# Altium project Motor Board.PrjPcb
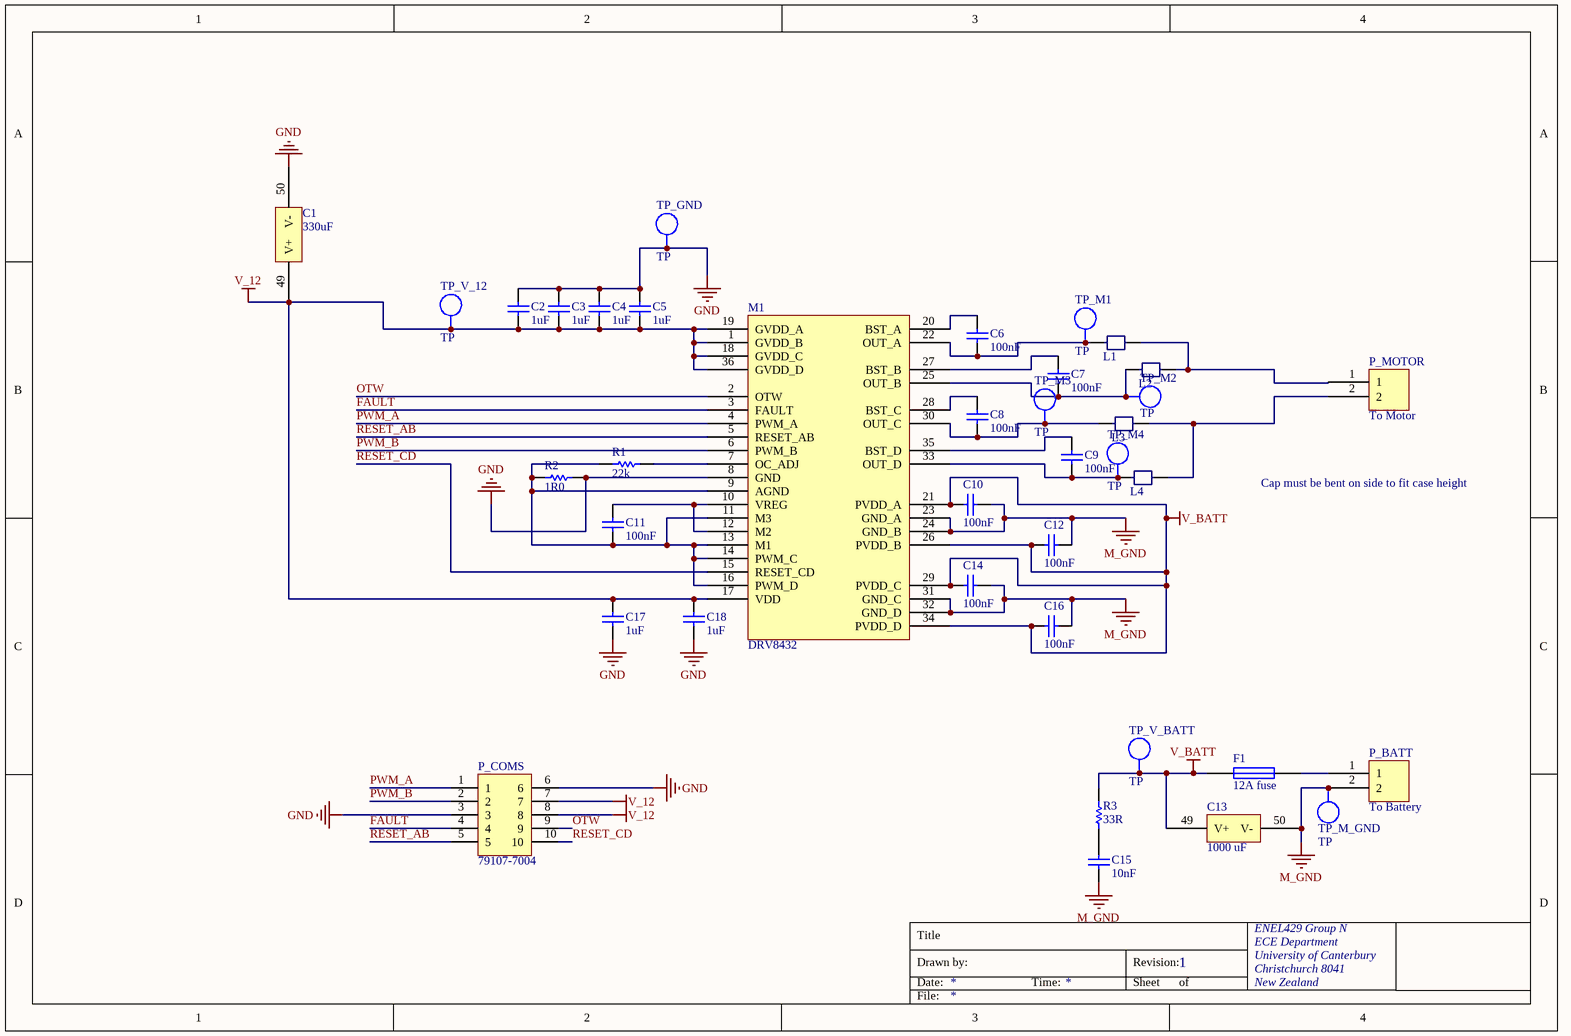
[diagram p0: Motor Driver.SchDoc]
1 sheet, 38 parts. Net scope: global (net labels, ports and power ports of the same name join across sheets).
Board file: Motor Board.PcbDoc

## Sheet Motor Driver.SchDoc
size A4; Organization: ENEL429 Group N; Address1: ECE Department; Address2: University of Canterbury; Address3: Christchurch 8041; Address4: New Zealand; Revision: 1

### Parts
C1  330uF  [330uF Capacitor]
C2  1uF  [0603]
C3  1uF  [0603]
C4  1uF  [0603]
C5  1uF  [0603]
C6  100nF  [0603]
C7  100nF  [0603]
C8  100nF  [0603]
C9  100nF  [0603]
C10  100nF  [0603]
C11  100nF  [0603]
C12  100nF  [0603]
C13  1000 uF  [Capacitor 1000uF]
C14  100nF  [0603]
C15  10nF  [0603]
C16  100nF  [0603]
C17  1uF  [0603]
C18  1uF  [0603]
F1  12A fuse  [RESC3216L]
L1  FERRITE BEAD 10A  (value not drawn)
L2  FERRITE BEAD 10A  (value not drawn)
L3  FERRITE BEAD 10A  (value not drawn)
L4  FERRITE BEAD 10A  (value not drawn)
M1  DRV8432  [DRV8432]
P_BATT  To Battery  [0010844020]
P_COMS  79107-7004  [79107-7004]
P_MOTOR  To Motor  [0010844020]
R1  22k  [0603]
R2  1R0  [0603]
R3  33R  [0603]
TP_GND  TP  [TEST_POINT_4X2MM]  (no BOM)
TP_M1  TP  [TEST_POINT_4X2MM]  (no BOM)
TP_M2  TP  [TEST_POINT_4X2MM]  (no BOM)
TP_M3  TP  [TEST_POINT_4X2MM]  (no BOM)
TP_M4  TP  [TEST_POINT_4X2MM]  (no BOM)
TP_M_GND  TP  [TEST_POINT_4X2MM]  (no BOM)
TP_V_12  TP  [TEST_POINT_4X2MM]  (no BOM)
TP_V_BATT  TP  [TEST_POINT_4X2MM]  (no BOM)

### Nets
GND: C1.50(V-) C2.1 C3.1 C4.1 C5.1 C17.2 C18.2 M1.8(GND) P_COMS.3 P_COMS.6 R2.2 TP_GND.1
M_GND: C10.1 C12.1 C13.50(V-) C14.1 C15.1 C16.1 M1.23(GND_A) M1.24(GND_B) M1.31(GND_C) M1.32(GND_D) P_BATT.2 TP_M_GND.1
V_12: C1.49(V+) C2.2 C3.2 C4.2 C5.2 C17.1 C18.1 M1.1(GVDD_B) M1.17(VDD) M1.18(GVDD_C) M1.19(GVDD_A) M1.36(GVDD_D) P_COMS.7 P_COMS.8 TP_V_12.1
V_BATT: C10.2 C12.2 C13.49(V+) C14.2 C16.2 F1.1 M1.21(PVDD_A) M1.26(PVDD_B) M1.29(PVDD_C) M1.34(PVDD_D) R3.2 TP_V_BATT.1
FAULT: M1.3(FAULT) P_COMS.4
OTW: M1.2(OTW) P_COMS.9
PWM_A: M1.4(PWM_A) P_COMS.1
PWM_B: M1.6(PWM_B) P_COMS.2
RESET_AB: M1.5(RESET_AB) P_COMS.5
RESET_CD: M1.15(RESET_CD) P_COMS.10
NetC6_1: C6.1 L1.1 M1.22(OUT_A) TP_M1.1
NetC6_2: C6.2 M1.20(BST_A)
NetC7_1: C7.1 L2.1 M1.25(OUT_B) TP_M2.1
NetC7_2: C7.2 M1.27(BST_B)
NetC8_1: C8.1 L3.1 M1.30(OUT_C) TP_M3.1
NetC8_2: C8.2 M1.28(BST_C)
NetC9_1: C9.1 L4.1 M1.33(OUT_D) TP_M4.1
NetC9_2: C9.2 M1.35(BST_D)
NetC11_1: C11.1 M1.9(AGND) M1.11(M3) M1.13(M1) M1.14(PWM_C) M1.16(PWM_D) R1.1 R2.1
NetC11_2: C11.2 M1.10(VREG) M1.12(M2)
NetC15_2: C15.2 R3.1
NetF1_2: F1.2 P_BATT.1
NetL1_2: L1.2 L2.2 P_MOTOR.1
NetL3_2: L3.2 L4.2 P_MOTOR.2
NetM1_7: M1.7(OC_ADJ) R1.2

### Notes on the sheet
- Cap must be bent on side to fit case height
- Title
- Drawn by:
- Date:
- Time:
- Revision:
- Sheet
- of
- File:

### Library data of the parts
C1 = AVE337M16F24T-F: pin to pad: 49>2 50>1; Manufacturer: CORNELL DUBILIER; Supplier 1: element 14; Supplier Part Number 1: 1780630; Manufacturer Part Number: AVE337M16F24T-F
C2-C5 C17 C18 = CP_1uF_50V_0603: CAP CER 1.0UF 50V X7R 0603; Manufacturer: Taiyo Yuden; Manufacturer PN: UMK107C5105KA-T; Supplier Part Number 1: 445-5090-2-ND; Supplier 1: Digi-Key; Value: 1uF; Part Number: CP_1uF_50V_0603; Component Kind: Standard; Component Type: Standard; Designator: CP_1uF_50V_0603; Pin Count: 2; Signal Integrity: Cap; Simulation: CAP
C6-C12 C14 C16 = CP_100nF 0603: CAP CER .10UF 50V X5R 0603; Manufacturer: Taiyo Yuden; Manufacturer PN: UMK107B7104KA-T; LatestRevisionDate: 29 May 08; Supplier 1: Digi-Key; Supplier Part Number 1: 478-6206-1-ND; Value: 100nF; Part Number: CP_100nF 0603; Component Kind: Standard; Component Type: Standard; Designator: CP_100nF 0603; Pin Count: 2; Signal Integrity: Cap; Simulation: CAP
C13 = EEUFK1V102L: pin to pad: 49>2 50>1; Supplier 1: element 14; Supplier Part Number 1: 1744967
C15 = CP_10nF 0603: CAP CER 10000PF 100V X7R 0603; Manufacturer: Taiyo Yuden; Manufacturer PN: HMK107B7103KA-T; Supplier 1: Digi-Key; Supplier Part Number 1: 587-1446-2-ND; Value: 10nF; Part Number: CP_10nF 0603; Component Kind: Standard; Component Type: Standard; Designator: CP_10nF 0603; Pin Count: 2; Signal Integrity: Cap; Simulation: CAP
F1 = Fuse 1: Fuse; Published: 8-Jun-2000; LatestRevisionDate: 17-Jul-2002; LatestRevisionNote: Re-released for DXP Platform.; PackageReference: PIN-W2/E2.8; Publisher: Altium Limited; Supplier 1: Digi-Key; Supplier Part Number 1: 1206SFH120F/24CT-ND
L1-L4 = 10A Ferrite bead: FERRITE 10A 56 OHM 1612 SMD; Supplier 1: Digi-Key; Supplier Part Number 1: 240-2499-1-ND
M1 = DRV8432: Motor Driver; Supplier 1: TI Samples; Supplier Part Number 1: DRV8432
P_BATT P_MOTOR = Power Header: Supplier Part Number 1: WM1256-ND; Supplier 1: Digi-Key
P_COMS = 79107-7004: CONN RECEPT 2MM 10POS VERT; Manufacturer: Molex; Manufacturer PN: 79107-7004; Supplier 1: Digi-Key; Supplier Part Number 1: WM18676-ND
R1 = RS_22k 0603: RES 22.0K OHM 1/10W 1% 0603 SMD; Manufacturer: Yageo; Manufacturer PN: RC0603FR-0722KL; LatestRevisionDate: 1 Jun 08; Supplier 1: Digi-Key; Supplier Part Number 1: P22.0KHDKR-ND; Value: 22k; Part Number: RS_22k 0603; Component Kind: Standard; Component Type: Standard; Designator: RS_22k 0603; Pin Count: 2; Signal Integrity: Res; Simulation: RESISTOR
R2 = RS_1R0 0603: RES 1R0 OHM 1/10W 1% 0603 SMD; Manufacturer: Yageo; Manufacturer PN: RC0603FR-07100KL; LatestRevisionDate: 29 May 08; Supplier 1: Digi-Key; Supplier Part Number 1: 311-1.00HRTR-ND; Value: 1R0; Part Number: RS_1R0 0603; Component Kind: Standard; Component Type: Standard; Designator: RS_1R0 0603; Pin Count: 2; Signal Integrity: Res; Simulation: RESISTOR
R3 = RS_33R 0603: RES 33 OHM 1/10W 1% 0603 SMD; Manufacturer: Yageo; Manufacturer PN: RC0603FR-0733KL; LatestRevisionDate: 6 May 2011; Supplier 1: Digi-Key; Supplier Part Number 1: 311-33.0HRTR-ND; Value: 33R; Part Number: RS_33R 0603; Component Kind: Standard; Component Type: Standard; Designator: RS_33R 0603; Pin Count: 2; Signal Integrity: Res; Simulation: RESISTOR
TP_GND TP_M1-TP_M4 TP_M_GND TP_V_12 TP_V_BATT = TP_TESTPOINT: Test-Point; LatestRevisionDate: 29 May 08; Manufacturer PN: *; Manufacturer: *; Supplier 1: Digi-Key; Supplier Part Number 1: 5016KTR-ND; Value: TP; Part Number: TP_TESTPOINT; Component Type: Standard (No BOM); Designator: TP_TESTPOINT; Pin Count: 1